# Altium schematic sheet Sheet2.SchDoc
size A3
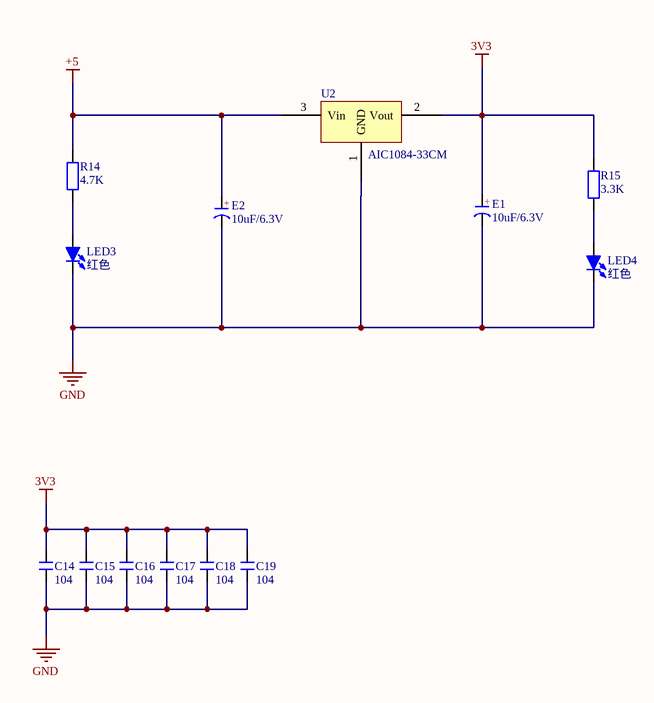
[diagram p0: Sheet2.SchDoc]

## Parts
C14  104  [C 0603_L]
C15  104  [C 0603_L]
C16  104  [C 0603_L]
C17  104  [C 0603_L]
C18  104  [C 0603_L]
C19  104  [C 0603_L]
E1  10uF/6.3V  [CD A(3216)]
E2  10uF/6.3V  [CD A(3216)]
LED3  红色  [LED 0603R]
LED4  红色  [LED 0603B]
R14  4.7K  [R 0603_L]
R15  3.3K  [R 0603_L]
U2  AIC1084-33CM  [TO263-3B]

## Nets
3V3: C14.2 C15.2 C16.2 C17.2 C18.2 C19.2 E1.1(A) R15.1 U2.2(Vout)
+5: E2.1(A) R14.1 U2.3(Vin)
GND: C14.1 C15.1 C16.1 C17.1 C18.1 C19.1 E1.2(K) E2.2(K) LED3.2(K) LED4.2(K) U2.1(GND)
NetLED3_1: LED3.1(A) R14.2
NetLED4_1: LED4.1(A) R15.2

## Notes on the sheet
- (in symbol C-CD) +

## Library data of the parts
C14-C19 = C: 无极性贴片电容; 版权归属: 源创客; BOM名称: 无极性贴片电容; 学习资源: www.ooocke.com
E1 E2 = C-CD: 贴片钽电容; 版权归属: 源创客; BOM名称: 贴片钽电容; 学习资源: www.ooocke.com
LED3 LED4 = LED-SMD: 贴片LED; 版权归属: 源创客; BOM名称: 贴片LED; 学习资源: www.ooocke.com
R14 R15 = R: 贴片电阻; 版权归属: 源创客; BOM名称: 贴片电阻; 学习资源: www.ooocke.com
U2 = AIC1084-33CM: pin to pad: 1>G 2>D 3>S